# EAGLE schematic Esquema_final_v1 (EAGLE 9.7.0)
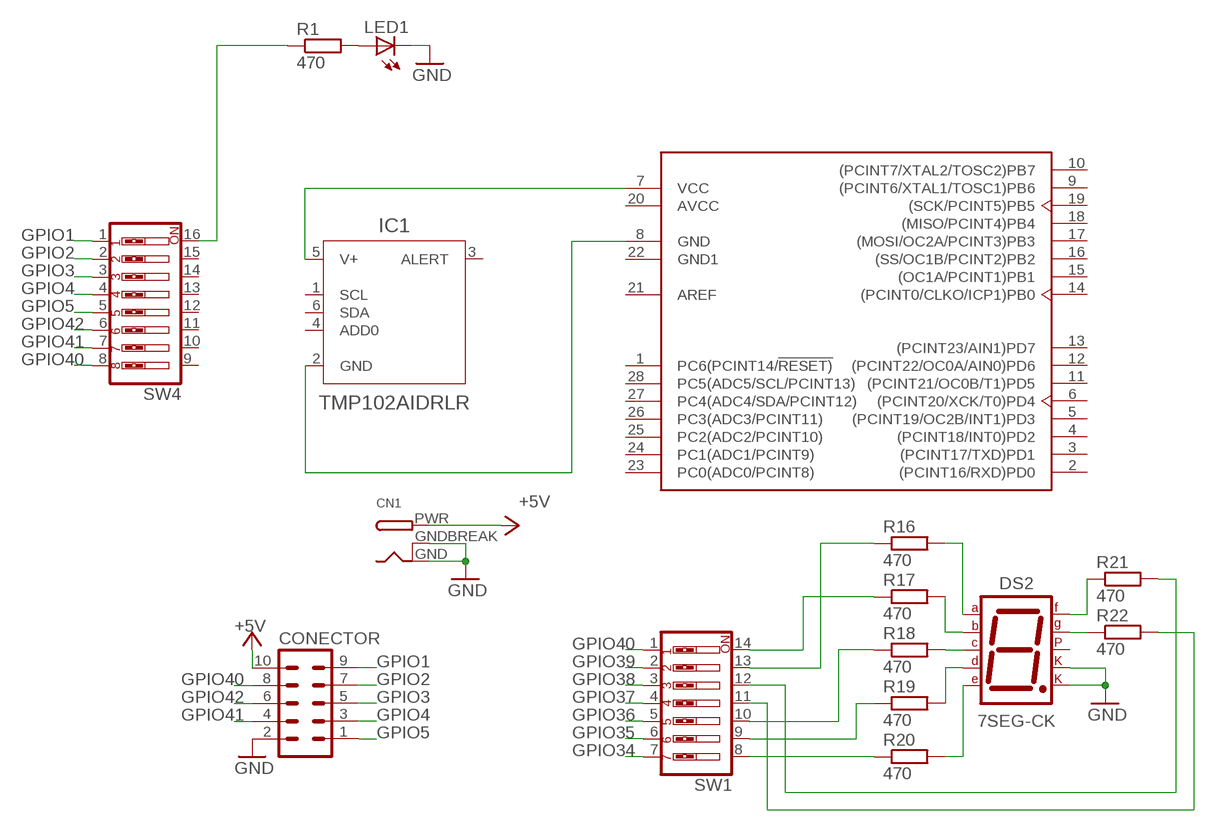
[diagram p0: schematic, sheet 1]

## Parts
CN1  DCBARRELPTH  [DCJACK_2MM_PTH]
CONECTOR  MA05-2  [MA05-2]
DS2  7SEG-CK  [7SEG-13]
IC1  TMP102AIDRLR  TMP102AIDRLT_SOT563  [SOT563]
LED1  LED5MM  [LED5MM]
R1  470  R-EU_0204/2V  [0204V]
R16  470  R-EU_0204/2V  [0204V]
R17  470  R-EU_0204/2V  [0204V]
R18  470  R-EU_0204/2V  [0204V]
R19  470  R-EU_0204/2V  [0204V]
R20  470  R-EU_0204/2V  [0204V]
R21  470  R-EU_0204/2V  [0204V]
R22  470  R-EU_0204/2V  [0204V]
SW1  SW_DIP-7  [EDG-07]
SW4  SW_DIP-8  [EDG-08]
U1  ATMEGA328P-PU  [DIP-28]

## Nets
+5V: CN1.PWR CONECTOR.10
GND: CN1.GND CN1.GNDBREAK CONECTOR.2 DS2.3(CK1) DS2.8(CK2) LED1.K(C)
GPIO1: CONECTOR.9 SW4.1
GPIO2: CONECTOR.7 SW4.2
GPIO3: CONECTOR.5 SW4.3
GPIO4: CONECTOR.3 SW4.4
GPIO5: CONECTOR.1 SW4.5
GPIO34: SW1.7
GPIO35: SW1.6
GPIO36: SW1.5
GPIO37: SW1.4
GPIO38: SW1.3
GPIO39: SW1.2
GPIO40: CONECTOR.8 SW1.1 SW4.8
GPIO41: CONECTOR.4 SW4.7
GPIO42: CONECTOR.6 SW4.6
N$1: IC1.2(GND) U1.8(GND)
N$2: LED1.A R1.2
N$3: IC1.5(V+) U1.7(VCC)
N$15: DS2.10(G) R22.1
N$16: DS2.9(F) R21.1
N$17: DS2.4(C) R18.2
N$18: DS2.2(D) R19.2
N$36: R1.1 SW4.16
N$46: DS2.1(E) R20.2
N$47: DS2.6(B) R17.2
N$48: DS2.7(A) R16.2
N$50: R19.1 SW1.9
N$51: R18.1 SW1.10
N$52: R17.1 SW1.14
N$53: R16.1 SW1.13
N$54: R21.2 SW1.12
N$55: R22.2 SW1.11
N$63: R20.1 SW1.8
Unconnected: DS2.5(DP) IC1.1(SCL) IC1.3(ALERT) IC1.4(ADD0) IC1.6(SDA) SW4.9 SW4.10 SW4.11 SW4.12 SW4.13 SW4.14 SW4.15 U1.1(PC6(PCINT14/!RESET)) U1.2((PCINT16/RXD)PD0) U1.3((PCINT17/TXD)PD1) U1.4((PCINT18/INT0)PD2) U1.5((PCINT19/OC2B/INT1)PD3) U1.6((PCINT20/XCK/T0)PD4) U1.9((PCINT6/XTAL1/TOSC1)PB6) U1.10((PCINT7/XTAL2/TOSC2)PB7) U1.11((PCINT21/OC0B/T1)PD5) U1.12((PCINT22/OC0A/AIN0)PD6) U1.13((PCINT23/AIN1)PD7) U1.14((PCINT0/CLKO/ICP1)PB0) U1.15((OC1A/PCINT1)PB1) U1.16((SS/OC1B/PCINT2)PB2) U1.17((MOSI/OC2A/PCINT3)PB3) U1.18((MISO/PCINT4)PB4) U1.19((SCK/PCINT5)PB5) U1.21(AREF) U1.23(PC0(ADC0/PCINT8)) U1.24(PC1(ADC1/PCINT9)) U1.25(PC2(ADC2/PCINT10)) U1.26(PC3(ADC3/PCINT11)) U1.27(PC4(ADC4/SDA/PCINT12)) U1.28(PC5(ADC5/SCL/PCINT13))

## Power pins joined to a net without a drawn wire
AVCC: U1.20(AVCC)
GND1: U1.22(GND1)

## Library data of the parts
CN1 = adafruit:DCBARREL: 2.0mm DC Barrel Jack DCJACK_2MM_PTH - Through Hole Jack (4UConnector: 05537)
CONECTOR = con-lstb:MA05-2: PIN HEADER; OC_FARNELL: unknown; OC_NEWARK: unknown
DS2 = Opto-Electronic:7SEG-CK: 7-segment DISPLAY single cathode, 13 mm; CATEGORY: Opto-Electronic; SUB-CATEGORY: Display; TYPE: 7-Segment
IC1 = Sensor:TMP102AIDRLT: SENSOR ANALOG -40C-125C TO92-3; CATEGORY: Sensor; MANUFACTURER: TI; MPN: TMP102AIDRLR; OPERATING_TEMP: -55 to 150 °C; PART_STATUS: Active; ROHS_COMPLIANT: RoHS3 Compliant; SUB-CATEGORY: Temperature
LED1 = adafruit:LED: LED OSRAM: - CHIPLED LG R971, LG N971, LY N971, LG Q971, LY Q971, LO R971, LY R971 LH N974, LH R974 LS Q976, LO Q976, LY Q976 LO Q996 - Hyper CHIPLED LW Q18S LB Q993, LB Q99A, LB R99A - SideLED LS A670, LO A670, LY A670, LG A670, LP A670 LB A673, LV A673, LT A673, LW A673 LH A674 LY A675 LS A676, LA A676, LO A676, LY A676, LW A676 LS A679, LY A679, LG A679 - Hyper Micro SIDELED® LS Y876, LA Y876, LO Y876, LY Y876 LT Y87S - SmartLED LW L88C, LW L88S LB L89C, LB L89S, LG L890 LS L89K, LO L89K, LY L89K LS L896, LA L896, LO L896, LY L896 - TOPLED LS T670, LO T670, LY T670, LG T670, LP T670 LSG T670, LSP T670, LSY T670, LOP T670, LYG T670 LG T671, LOG T671, LSG T671 LB T673, LV T673, LT T673, LW T673 LH T674 LS T676, LA T676, LO T676, LY T676, LB T676, LH T676, LSB T676, LW T676 LB T67C, LV T67C, LT T67C, LS T67K, LO T67K, LY T67K, LW E67C LS E67B, LA E67B, LO E67B, LY E67B, LB E67C, LV E67C, LT E67C LW T67C LS T679, LY T679, LG T679 LS T770, LO T770, LY T770, LG T770, LP T770 LB T773, LV T773, LT T773, LW T773 LH T774 LS E675, LA E675, LY E675, LS T675 LS T776, LA T776, LO T776, LY T776, LB T776 LHGB T686 LT T68C, LB T68C - Hyper Mini TOPLED® LB M676 - Mini TOPLED Santana® LG M470 LS M47K, LO M47K, LY M47K Source: http://www.osram.convergy.de/
R1 R16-R22 = rcl:R-EU_: RESISTOR, European symbol; SPICEPREFIX: R
SW1 = special:SW_DIP-7: DIP SWITCH
SW4 = special:SW_DIP-8: DIP SWITCH
U1 = Microcontroller:ATMEGA328P-PU: IC MCU 8BIT 32KB FLASH 28DIP Manufacturer's datasheet <http://ww1.microchip.com/downloads/en/DeviceDoc/ATmega48A-PA-88A-PA-168A-PA-328-P-DS-DS40002061A.pdf>; CREATED_BY: PCBLayout.com; DIGIKEY_PART_NUMBER: ATMEGA328P-PU-ND; MANUFACTURER: Microchip Technology; MPN: ATMEGA328P-PU; PACKAGE: DIP-28